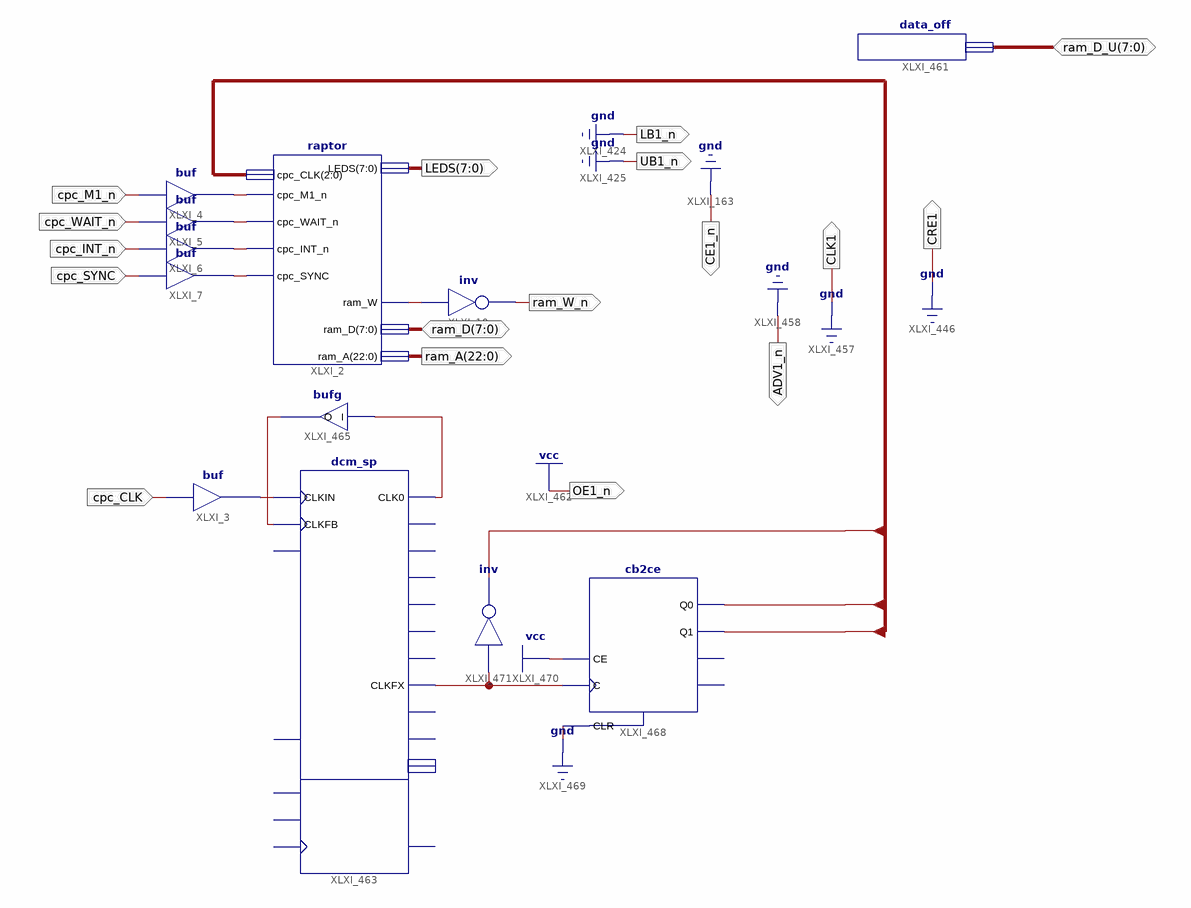
[diagram p0: schematic sheet 1]
// Xilinx ISE schematic amstrad_oscillo.sch (spartan3e) as structural Verilog: 12 symbols, 17 ports
module amstrad_oscillo (
  input  cpc_M1_n,
  input  cpc_WAIT_n,
  input  cpc_INT_n,
  input  cpc_SYNC,
  input  cpc_CLK,
  inout  [7:0] ram_D,
  inout  [7:0] ram_D_U,
  output [7:0] LEDS,
  output [22:0] ram_A,
  output ram_W_n,
  output UB1_n,
  output LB1_n,
  output ADV1_n,
  output CLK1,
  output CRE1,
  output OE1_n,
  output CE1_n
);

  wire XLXN_2, XLXN_3, XLXN_4, XLXN_5, XLXN_6, XLXN_10, XLXN_14, XLXN_15, XLXN_19;
  wire [2:0] CLK3;

  raptor XLXI_2 (
    .cpc_M1_n(XLXN_3), .cpc_WAIT_n(XLXN_4), .cpc_INT_n(XLXN_5), .cpc_SYNC(XLXN_6), .ram_D(ram_D),
    .ram_W(XLXN_10), .ram_A(ram_A), .LEDS(LEDS), .cpc_CLK(CLK3));
  buf XLXI_5 (XLXN_4, cpc_WAIT_n);
  buf XLXI_6 (XLXN_5, cpc_INT_n);
  buf XLXI_7 (XLXN_6, cpc_SYNC);
  not XLXI_10 (ram_W_n, XLXN_10);
  data_off XLXI_461 (.off(ram_D_U));
  dcm_sp XLXI_463 (
    .CLKFB(XLXN_15), .CLKIN(XLXN_2), .CLK0(XLXN_14), .CLKFX(XLXN_19));  // open: DSSEN, PSCLK, PSEN, PSINCDEC, RST, CLK180, CLK270, CLK2X, CLK2X180, CLK90, CLKDV, CLKFX180, LOCKED, PSDONE, STATUS
  bufg XLXI_465 (.I(XLXN_14), .O(XLXN_15));
  buf XLXI_4 (XLXN_3, cpc_M1_n);
  buf XLXI_3 (XLXN_2, cpc_CLK);
  cb2ce XLXI_468 (.C(XLXN_19), .CE(1'b1), .CLR(1'b0), .Q0(CLK3[1]), .Q1(CLK3[2]));  // open: CEO, TC
  not XLXI_471 (CLK3[0], XLXN_19);

  assign ADV1_n = 1'b0;
  assign CE1_n = 1'b0;
  assign CLK1 = 1'b0;
  assign CRE1 = 1'b0;
  assign LB1_n = 1'b0;
  assign OE1_n = 1'b1;
  assign UB1_n = 1'b0;
endmodule
